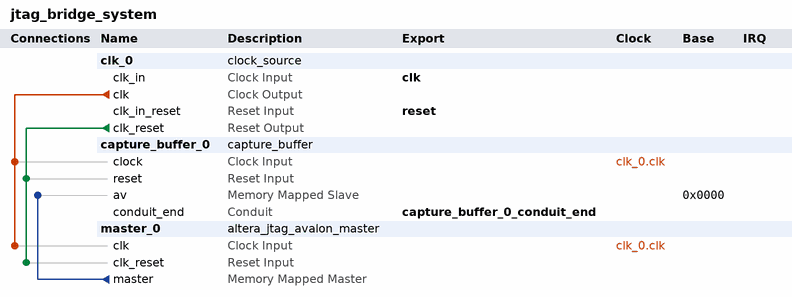
[diagram p0: system contents]
# Platform Designer (Qsys) system jtag_bridge_system, Cyclone V 5CEBA4F23C7
# Parameters at their usual value, and those the tool derives, are not listed.
package require -exact qsys 24.1
create_system jtag_bridge_system
set_project_property DEVICE_FAMILY {Cyclone V}
set_project_property DEVICE 5CEBA4F23C7

add_instance clk_0 clock_source 24.1
set_instance_parameter_value clk_0 clockFrequency 50000000

add_instance capture_buffer_0 capture_buffer 1.0
set_instance_parameter_value capture_buffer_0 BUFFER_ADDR_BITS 13

add_instance master_0 altera_jtag_avalon_master 24.1

# connections
add_connection clk_0.clk capture_buffer_0.clock clock
add_connection clk_0.clk master_0.clk clock
add_connection clk_0.clk_reset capture_buffer_0.reset reset
add_connection clk_0.clk_reset master_0.clk_reset reset
add_connection master_0.master capture_buffer_0.av avalon
set_connection_parameter_value master_0.master/capture_buffer_0.av baseAddress 0x0000

# exported interfaces
add_interface capture_buffer_0_conduit_end conduit end
set_interface_property capture_buffer_0_conduit_end EXPORT_OF capture_buffer_0.conduit_end
add_interface clk clock sink
set_interface_property clk EXPORT_OF clk_0.clk_in
add_interface reset reset sink
set_interface_property reset EXPORT_OF clk_0.clk_in_reset

set_interconnect_requirement {$system} qsys_mm.clockCrossingAdapter HANDSHAKE
set_interconnect_requirement {$system} qsys_mm.enableEccProtection FALSE
set_interconnect_requirement {$system} qsys_mm.insertDefaultSlave FALSE
set_interconnect_requirement {$system} qsys_mm.maxAdditionalLatency 1

save_system jtag_bridge_system.qsys
